# Altium schematic sheet ECU_AutoRC_PWR_SUPPLY_r00.SchDoc
size A4; SheetNumber: 1; SheetTotal: 8
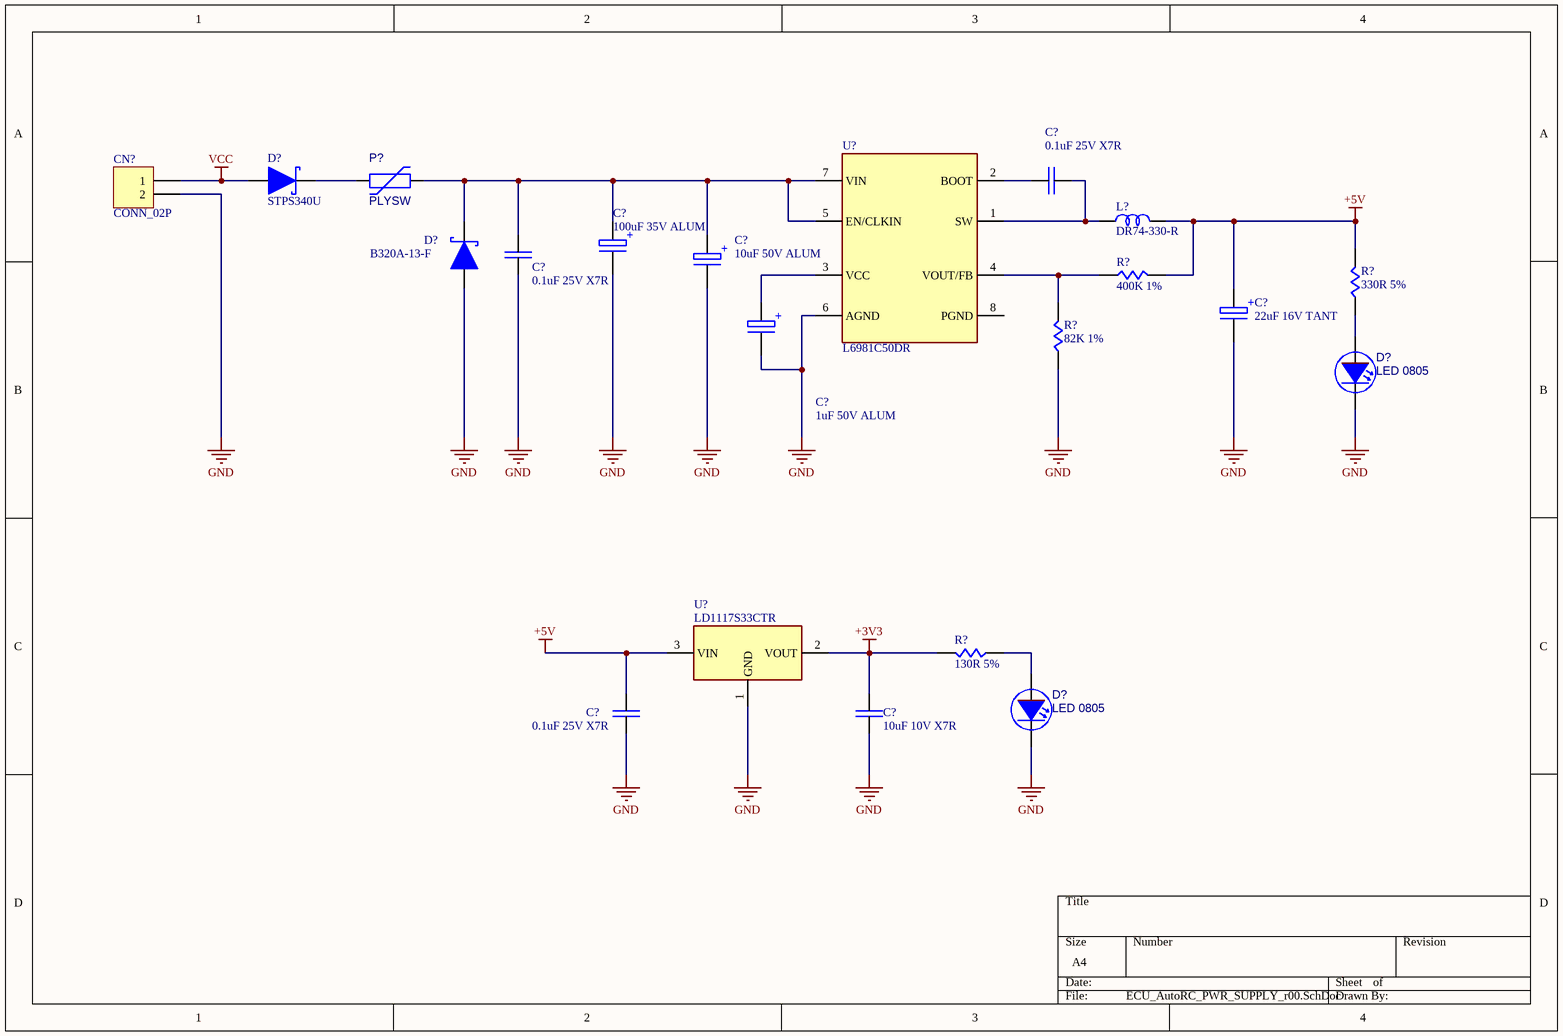
[diagram p0: ECU_AutoRC_PWR_SUPPLY_r00.SchDoc]

## Parts
(Parts that share a designator on the sheet are numbered #1, #2 ... from top to bottom, then left to right.)
C?#1  0.1uF 25V X7R
C?#2  100uF 35V ALUM
C?#3  0.1uF 25V X7R
C?#4  10uF 50V ALUM
C?#5  22uF 16V TANT
C?#6  1uF 50V ALUM
C?#7  0.1uF 25V X7R
C?#8  10uF 10V X7R
CN?  CONN_02P
D?#1  STPS340U
D?#2  B320A-13-F
D?#3  LED 0805
D?#4  LED 0805
L?  DR74-330-R
P?  PLYSW
R?#1  400K 1%
R?#2  330R 5%
R?#3  82K 1%
R?#4  130R 5%
U?#1  L6981C50DR  [8-SOIC]
U?#2  LD1117S33CTR

## Nets
+3V3: C?#8.1 R?#4.2 U?#2.2(VOUT)
+5V: C?#5.1 C?#7.1 L?.2 R?#1.2 R?#2.2 U?#2.3(VIN)
GND: C?#2.2 C?#3.2 C?#4.2 C?#5.2 C?#6.2 C?#7.2 C?#8.2 CN?.2 D?#2.1(Anode) D?#3.2(K) D?#4.2(K) R?#3.1 U?#1.6(AGND) U?#2.1(GND)
VCC: CN?.1 D?#1.1(Anode)
NetC?#1_1: C?#1.1 U?#1.2(BOOT)
NetC?#1_2: C?#1.2 L?.1 U?#1.1(SW)
NetC?#2_1: C?#2.1 C?#3.1 C?#4.1 D?#2.2(Catode) P?.2 U?#1.5(EN/CLKIN) U?#1.7(VIN)
NetC?#6_1: C?#6.1 U?#1.3(VCC)
NetD?#1_2: D?#1.2(Catode) P?.1
NetD?#3_1: D?#3.1(A) R?#2.1
NetD?#4_1: D?#4.1(A) R?#4.1
NetR?#1_1: R?#1.1 R?#3.2 U?#1.4(VOUT/FB)

Not connected (* = marked no-connect by the designer): U?#1 8(PGND)

## Notes on the sheet
- (in symbol Capacitor Polarizado) +

## Library data of the parts
C?#1 C?#3 C?#7 C?#8 = Capacitor NP: Non Polarizated Capacitor
C?#2 C?#4-C?#6 = Capacitor Polarizado: Polarizated Capacitor
CN? = CONN_02P: 2 Pin Connector
D?#1 D?#2 = Diode_Schottky: Diode Schottky
D?#3 D?#4 = LED
L? = Inductor
P? = PLYSW: Polyswitch
R?#1-R?#4 = Resistor
U?#1 = L6981C50DR: IC REG BUCK 5V 1.5A 8SO
U?#2 = LD1117S33CTR: IC REG LINEAR 3.3V 800MA SOT-223